# Altium schematic sheet MCU.SchDoc: Gimbal - Microcontroller
size Letter; DrawnBy: Aidan Gratton; Organization: UW Robotics; Address1: 200 University Avenue; Address2: Waterloo; Address3: Ontario; Address4: Canada N2L 3G6; SheetNumber: 4; SheetTotal: 7
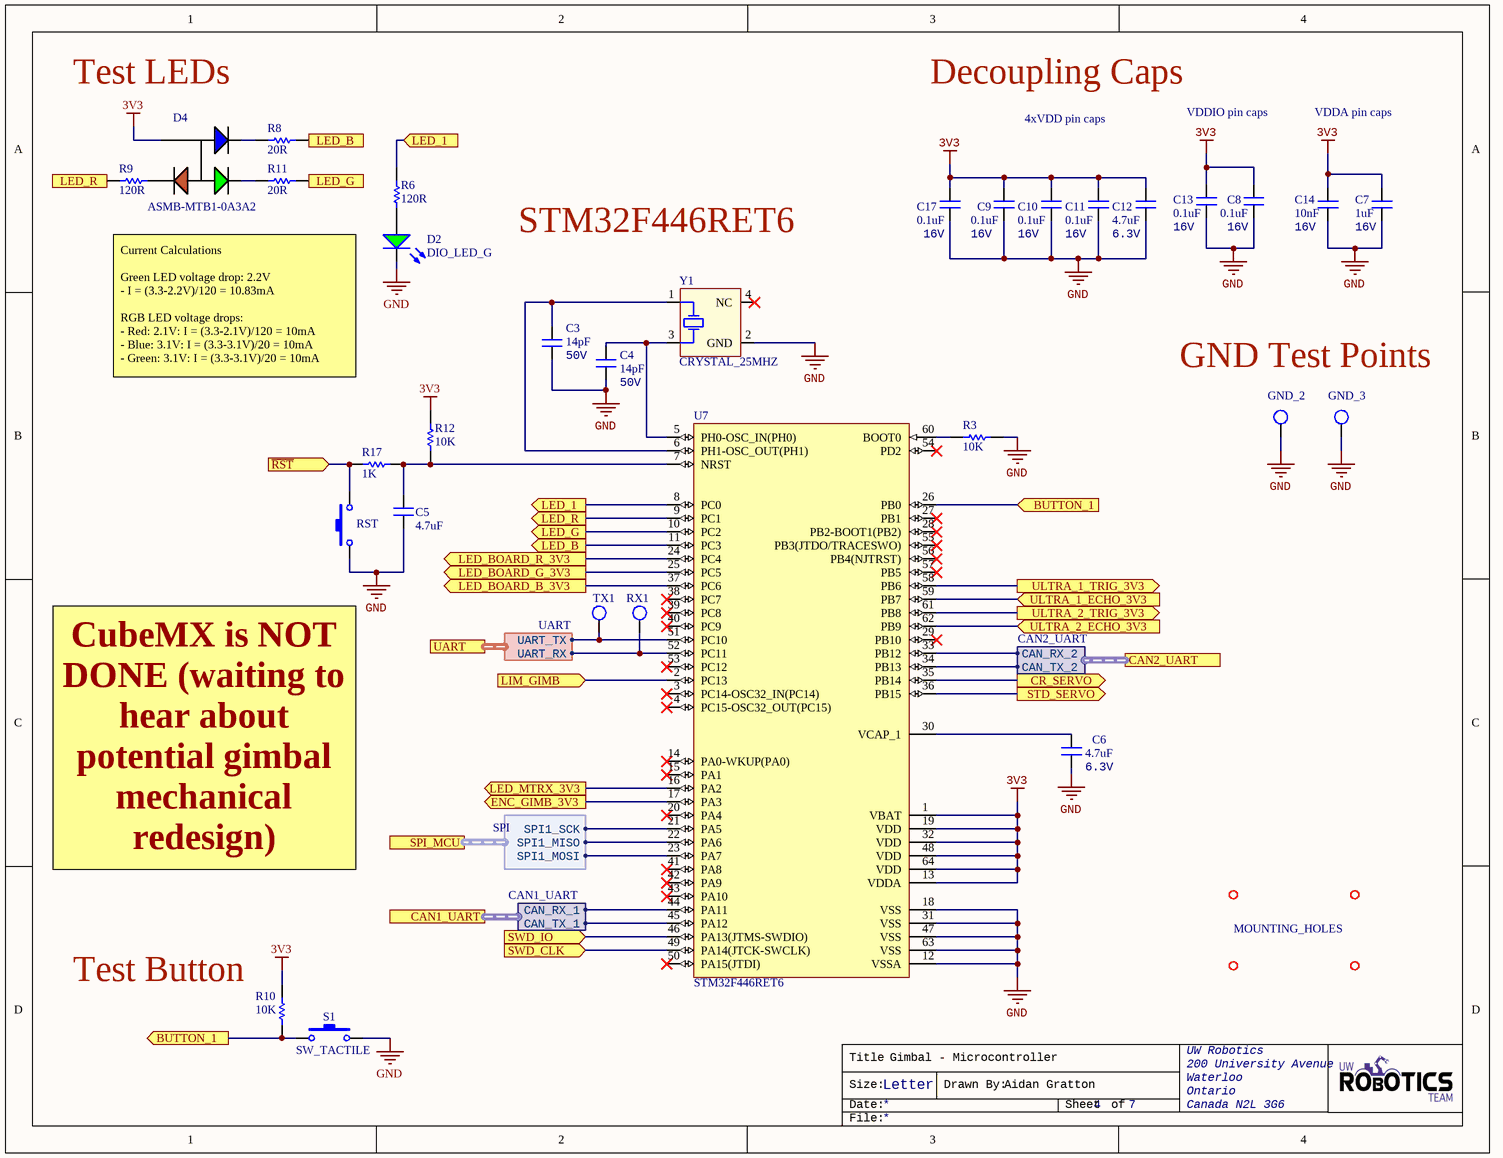
[diagram p0: MCU.SchDoc]

## Parts
C3  value 14pF  Voltage Rating (DC): 50V  [CAPC0603(1608)55_N]  (hidden comment: CL10C140JB8NNNC)
C4  value 14pF  Voltage Rating (DC): 50V  [CAPC0603(1608)55_N]  (hidden comment: CL10C140JB8NNNC)
C5  value 4.7uF  [CAPC0603(1608)55_N]  (hidden comment: CAP_4.7uF_0603)
C6  value 4.7uF  Voltage Rating: 6.3V  [CAPC0603(1608)55_N]  (hidden comment: CAP_4.7uF_0603)
C7  value 1uF  Voltage Rating: 16V  [CAPC0603(1608)55_N]  (hidden comment: CAP_1uF_16V_0603)
C8  value 0.1uF  Voltage Rating: 16V  [CAPC0603(1608)55_N]  (hidden comment: CAP_0.1uF_16V_0603)
C9  value 0.1uF  Voltage Rating: 16V  [CAPC0603(1608)55_N]  (hidden comment: CAP_0.1uF_16V_0603)
C10  value 0.1uF  Voltage Rating: 16V  [CAPC0603(1608)55_N]  (hidden comment: CAP_0.1uF_16V_0603)
C11  value 0.1uF  Voltage Rating: 16V  [CAPC0603(1608)55_N]  (hidden comment: CAP_0.1uF_16V_0603)
C12  value 4.7uF  Voltage Rating: 6.3V  [CAPC0603(1608)55_N]  (hidden comment: CAP_4.7uF_0603)
C13  value 0.1uF  Voltage Rating: 16V  [CAPC0603(1608)55_N]  (hidden comment: CAP_0.1uF_16V_0603)
C14  value 10nF  Voltage Rating: 16V  [CAPC0603(1608)55_N]  (hidden comment: CAP_10nF_0603)
C17  value 0.1uF  Voltage Rating: 16V  [CAPC0603(1608)55_N]  (hidden comment: CAP_0.1uF_16V_0603)
D2  DIO_LED_G  [LED_0805_LINE]
D4  Manufacturer Part Number 1: ASMB-MTB1-0A3A2  [LED_RGB]  (hidden comment: LED_RGB)
GND_2  TESTPOINT_LOOP  [TESTPOINT_LOOP]  (value not drawn)
GND_3  TESTPOINT_LOOP  [TESTPOINT_LOOP]  (value not drawn)
MH1  MOUNTING_HOLES  [MOUNTING_HOLE]
MH2  MOUNTING_HOLES  [MOUNTING_HOLE]  (value not drawn)
MH3  MOUNTING_HOLES  [MOUNTING_HOLE]  (value not drawn)
MH4  MOUNTING_HOLES  [MOUNTING_HOLE]  (value not drawn)
R3  value 10K  [RESC0603(1608)_N]  (hidden comment: RES_10K_0603)
R6  value 120R  [RESC0603(1608)_N]  (hidden comment: RES_120R_0603)
R8  value 20R  [RESC0603(1608)_N]  (hidden comment: RES_20R_0603)
R9  value 120R  [RESC0603(1608)_N]  (hidden comment: RES_120R_0603)
R10  value 10K  [RESC0603(1608)_N]  (hidden comment: RES_10K_0603)
R11  value 20R  [RESC0603(1608)_N]  (hidden comment: RES_20R_0603)
R12  value 10K  [RESC0603(1608)_N]  (hidden comment: RES_10K_0603)
R17  value 1K  [RESC0603(1608)_N]  (hidden comment: RES_1K_0603)
RST  SW_PWR  [PTS830GM140]  (value not drawn)
RX1  TESTPOINT_LOOP  [TESTPOINT_LOOP]  (value not drawn)
S1  SW_TACTILE  [B3U-1100P]
TX1  TESTPOINT_LOOP  [TESTPOINT_LOOP]  (value not drawn)
U7  STM32F446RET6  [STM-LQFP64_L]
Y1  CRYSTAL_25MHZ  [AVX-CX2520DB32000D0GEJZ1-4_V]

## Ports
BUTTON_1 (in), BUTTON_1 (out), CAN1_UART (harness CAN1_UART), CAN2_UART (harness CAN2_UART), CR_SERVO (out), ENC_GIMB_3V3 (out), LED_1 (in), LED_1 (out), LED_B (in), LED_B (out), LED_BOARD_B_3V3 (out), LED_BOARD_G_3V3 (out), LED_BOARD_R_3V3 (out), LED_G (in), LED_G (out), LED_MTRX_3V3 (out), LED_R (in), LED_R (out), LIM_GIMB (in), SPI_MCU (harness SPI), STD_SERVO (out), SWD_CLK (in), SWD_IO (in), UART (harness UART), ULTRA_1_ECHO_3V3 (in), ULTRA_1_TRIG_3V3 (out), ULTRA_2_ECHO_3V3 (in), ULTRA_2_TRIG_3V3 (out), ~{RST} (in)

## Harnesses
UART: UART_RX, UART_TX
CAN1_UART: CAN_RX_1, CAN_TX_1
CAN2_UART: CAN_RX_2, CAN_TX_2
SPI: SPI1_SCK, SPI1_MISO, SPI1_MOSI

## Nets
3V3: C7.2 C8.2 C9.2 C10.2 C11.2 C12.2 C13.2 C14.2 C17.2 D4.4 R10.1 R12.2 U7.1(VBAT) U7.13(VDDA) U7.19(VDD) U7.32(VDD) U7.48(VDD) U7.64(VDD)
GND: C3.1 C4.1 C5.1 C6.1 C7.1 C8.1 C9.1 C10.1 C11.1 C12.1 C13.1 C14.1 C17.1 D2.2(K) GND_2.1 GND_3.1 R3.2 RST.1 S1.2 U7.12(VSSA) U7.18(VSS) U7.31(VSS) U7.47(VSS) U7.63(VSS) Y1.2(GND)
~{RST}: R17.1 RST.2 ; port ~{RST}
BUTTON_1: R10.2 S1.1 U7.26(PB0) ; port BUTTON_1
CR_SERVO: U7.35(PB14) ; port CR_SERVO
ENC_GIMB_3V3: U7.17(PA3) ; port ENC_GIMB_3V3
LED_1: R6.1 U7.8(PC0) ; port LED_1
LED_B: R8.2 U7.11(PC3) ; port LED_B
LED_BOARD_B_3V3: U7.37(PC6) ; port LED_BOARD_B_3V3
LED_BOARD_G_3V3: U7.25(PC5) ; port LED_BOARD_G_3V3
LED_BOARD_R_3V3: U7.24(PC4) ; port LED_BOARD_R_3V3
LED_G: R11.2 U7.10(PC2) ; port LED_G
LED_MTRX_3V3: U7.16(PA2) ; port LED_MTRX_3V3
LED_R: R9.1 U7.9(PC1) ; port LED_R
LIM_GIMB: U7.2(PC13) ; port LIM_GIMB
STD_SERVO: U7.36(PB15) ; port STD_SERVO
SWD_CLK: U7.49(PA14(JTCK-SWCLK)) ; port SWD_CLK
SWD_IO: U7.46(PA13(JTMS-SWDIO)) ; port SWD_IO
ULTRA_1_ECHO_3V3: U7.59(PB7) ; port ULTRA_1_ECHO_3V3
ULTRA_1_TRIG_3V3: U7.58(PB6) ; port ULTRA_1_TRIG_3V3
ULTRA_2_ECHO_3V3: U7.62(PB9) ; port ULTRA_2_ECHO_3V3
ULTRA_2_TRIG_3V3: U7.61(PB8) ; port ULTRA_2_TRIG_3V3
NetC3_2: C3.2 U7.6(PH1-OSC_OUT(PH1)) Y1.1(HOT)
NetC4_2: C4.2 U7.5(PH0-OSC_IN(PH0)) Y1.3(HOT)
NetC5_2: C5.2 R12.1 R17.2 U7.7(NRST)
NetC6_2: C6.2 U7.30(VCAP_1)
NetD2_1: D2.1(A) R6.2
NetD4_1: D4.1 R9.2
NetD4_2: D4.2 R11.1
NetD4_3: D4.3 R8.1
NetR3_1: R3.1 U7.60(BOOT0)
NetRX1_1: RX1.1 U7.52(PC11) ; port UART.UART_RX
NetTX1_1: TX1.1 U7.51(PC10) ; port UART.UART_TX
NetU7_21: U7.21(PA5) ; port SPI_MCU.SPI1_SCK
NetU7_22: U7.22(PA6) ; port SPI_MCU.SPI1_MISO
NetU7_23: U7.23(PA7) ; port SPI_MCU.SPI1_MOSI
NetU7_33: U7.33(PB12) ; port CAN2_UART.CAN_RX_2
NetU7_34: U7.34(PB13) ; port CAN2_UART.CAN_TX_2
NetU7_44: U7.44(PA11) ; port CAN1_UART.CAN_RX_1
NetU7_45: U7.45(PA12) ; port CAN1_UART.CAN_TX_1

Not connected (* = marked no-connect by the designer): U7 3(PC14-OSC32_IN(PC14))* 4(PC15-OSC32_OUT(PC15))* 14(PA0-WKUP(PA0))* 15(PA1)* 20(PA4)* 27(PB1)* 28(PB2-BOOT1(PB2))* 29(PB10)* 38(PC7)* 39(PC8)* 40(PC9)* 41(PA8)* 42(PA9)* 43(PA10)* 50(PA15(JTDI))* 53(PC12)* 54(PD2)* 55(PB3(JTDO/TRACESWO))* 56(PB4(NJTRST))* 57(PB5)*; Y1 4(NC)*

## Notes on the sheet
- Test LEDs
- Decoupling Caps
- 4xVDD pin caps
- VDDIO pin caps
- VDDA pin caps
- STM32F446RET6
- Current Calculations
  Green LED voltage drop: 2.2V
  - I = (3.3-2.2V)/120 = 10.83mA
  RGB LED voltage drops:
  - Red: 2.1V: I = (3.3-2.1V)/120 = 10mA
  - Blue: 3.1V: I = (3.3-3.1V)/20 = 10mA
  - Green: 3.1V: I = (3.3-3.1V)/20 = 10mA
- GND Test Points
- CubeMX is NOT DONE (waiting to hear about potential gimbal mechanical redesign)
- (near R10) Test Button
- Title
- Size:
- Date:
- Letter
- Drawn By:
- Sheet
- of
- File:

## Library data of the parts
C3 C4 = CL10C140JB8NNNC: Cap Ceramic 14pF 50V C0G 5% SMD 0603 125C Cardboard T/R; Manufacturer 1: Samsung; Voltage Rating: 50V; Supplier Part Number 1: 1276-2187-1-ND; Supplier 1: Digi-Key; Manufacturer Part Number 1: CL10C140JB8NNNC; Stock 1: 187088; Pricing 1: 1=0.10000, 10=0.06700, 100=0.02980, 500=0.02130, 1000=0.01673 (USD); RoHS: Yes; Mount: Surface Mount; Case/Package: 0603; Case Code (Metric): 1608; Case Code (Imperial): 0603; Min Operating Temperature: -55°C; Max Operating Temperature: 125°C; Tolerance: 5%; Package Quantity: 1; Packaging: Tape and Reel; Dielectric: C0G; Length: 1.6mm; Height: 0.8mm; Width: 0.031inch; Depth: 0.8mm; Thickness: 0.035inch; Radiation Hardening: No; ComponentLink1URL: https://datasheet.ciiva.com/25782/cl10c140jb8nnnc-25782947.pdf?src-supplier=Digi-Key; ComponentLink1Description: https://datasheet.ciiva.com/25782/cl10c140jb8nnnc-25782947.pdf?src-supplier=Digi-Key; Capacitance: 14pF
C5 = CAP_4.7uF_0603: CAP CER 4.7UF 6.3V X5R 0603; Manufacturer Part Number 1: CC0603KRX5R5BB475; Manufacturer 1: Yageo; Dimensions: 0.063" L x 0.031" W (1.60mm x 0.80mm); Package: 0603 (1608 Metric); Temperature Coefficient: X5R; Voltage Rating: 6.3V; Supplier Part Number 1: 311-1521-1-ND; Supplier 1: Digi-Key; Mount: Surface Mount
C6 C12 = CAP_4.7uF_0603: CAP CER 4.7UF 6.3V X5R 0603; Manufacturer: Yageo; MPN: CC0603KRX5R5BB475; Dimensions: 0.063" L x 0.031" W (1.60mm x 0.80mm); Package: 0603 (1608 Metric); Temperature Coefficient: X5R; Supplier Part Number 1: 311-1521-1-ND; Supplier 1: Digi-Key
C7 = CAP_1uF_16V_0603: CAP CER 1UF 16V Y5V 0603; Manufacturer: Yageo; MPN: CC0603ZRY5V7BB105; Dimensions: 0.063" L x 0.031" W (1.60mm x 0.80mm); Package: 0603 (1608 Metric); Temperature Coefficient: Y5V; Supplier Part Number 1: 311-1372-1-ND; Supplier 1: Digi-Key
C8-C11 C13 C17 = CAP_0.1uF_16V_0603: CAP CER 0.1UF 16V X7R 0603; Manufacturer: Yageo; MPN: CC0603KRX7R7BB104; Dimensions: 0.063" L x 0.031" W (1.60mm x 0.80mm); Package: 0603 (1608 Metric); Temperature Coefficient: X7R; Supplier Part Number 1: 311-1088-1-ND; Supplier 1: Digi-Key
C14 = CAP_10nF_0603: CAP CER 10000PF 16V X7R 0603; Manufacturer: Yageo; MPN: CC0603KRX7R7BB103; Dimensions: 0.063" L x 0.031" W (1.60mm x 0.80mm); Package: 0603 (1608 Metric); Temperature Coefficient: X7R; Supplier Part Number 1: 311-3369-1-ND; Supplier 1: Digi-Key
D2 = DIO_LED_G: LED GREEN DIFFUSED 0805 SMD; Manufacturer: OSRAM; MPN: LG R971-KN-1; Forward Voltage Drop: 2.2V; Package: 0805 (2012 Metric); Supplier Part Number 1: 475-1410-1-ND; Supplier 1: Digi-Key
D4 = LED_RGB: LED RGB DIFFUSED 4PLCC SMD; Manufacturer 1: Broadcom; Color: Blue,Green,Red; Lens Color: White; Viewing Angle: 115°; Lens Style: Round; Luminous Intensity: 350mcd; Dominant Wavelength: 470nm; Forward Voltage: 3.1V; Test Current: 20mA; Supplier 1: Digi-Key; Stock 1: 142531; Pricing 1: 1=0.60000, 10=0.47100, 100=0.30210, 500=0.25980, 1000=0.20059 (USD); RoHS: Yes; Mount: Surface Mount; Case/Package: PLCC; Number of Pins: 4; Packaging: Cut Tape; Lens Transparency: Diffused; Length: 3.2mm; Height: 1.9mm; Width: 2.8mm; REACH SVHC: No SVHC; ComponentLink1URL: http://www.farnell.com/datasheets/2111106.pdf?src-supplier=Farnell; ComponentLink1Description: http://www.farnell.com/datasheets/2111106.pdf?src-supplier=Farnell; ComponentLink2URL: https://docs.broadcom.com/docs/AV02-4194EN?src-supplier=Digi-Key; ComponentLink2Description: https://docs.broadcom.com/docs/AV02-4194EN?src-supplier=Digi-Key; ComponentLink3URL: http://www.farnell.com/datasheets/1801564.pdf?src-supplier=Element14; ComponentLink3Description: http://www.farnell.com/datasheets/1801564.pdf?src-supplier=Element14; ComponentLink4URL: http://www.farnell.com/datasheets/2111106.pdf?src-supplier=Newark; ComponentLink4Description: http://www.farnell.com/datasheets/2111106.pdf?src-supplier=Newark; Supplier Part Number 1: 516-3280-1-ND
GND_2 GND_3 RX1 TX1 = TESTPOINT_LOOP: Loop testpoint through-hole pad; Manufacturer: Keystone Electronics; Manufacturer Part Number 1: 5002; Supplier Part Number 1: 36-5002-ND; Supplier 1: Digi-Key
MH1-MH4 = MOUNTING_HOLES: 6cm x 6cm
R3 R10 R12 = RES_10K_0603: RES SMD 10K OHM 5% 1/10W 0603; Manufacturer: Yageo; MPN: RC0603JR-0710KL; Package: 0603 (1608 Metric); Dimensions: 0.063" L x 0.031" W (1.60mm x 0.80mm); Tolerance: 5%; Supplier Part Number 1: 311-10KGRCT-ND; Supplier 1: Digi-Key
R6 R9 = RES_120R_0603: RES SMD 120 OHM 5% 1/10W 0603; Manufacturer: Yageo; MPN: RC0603JR-07120RL; Package: 0603 (1608 Metric); Dimensions: 0.063" L x 0.031" W (1.60mm x 0.80mm); Tolerance: 5%; Supplier Part Number 1: 311-120GRCT-ND; Supplier 1: Digi-Key
R8 R11 = RES_20R_0603: RES SMD 20 OHM 5% 1/10W 0603; Manufacturer: Yageo; MPN: RC0603JR-0720RL; Package: 0603 (1608 Metric); Dimensions: 0.063" L x 0.031" W (1.60mm x 0.80mm); Tolerance: 5%; Supplier Part Number 1: 311-20GRCT-ND; Supplier 1: Digi-Key
R17 = RES_1K_0603: RES SMD 1K OHM 5% 1/10W 0603; Manufacturer 1: Yageo; Manufacturer Part Number 1: RC0603JR-071KL; Dimensions: 0.063" L x 0.031" W (1.60mm x 0.80mm); Tolerance: 5%; Package: 0603 (1608 Metric); Supplier Part Number 1: 311-1.0KGRCT-ND; Supplier 1: Digi-Key; Mount: Surface Mount
RST = SW_PWR: Power Switch (Red); pin to pad: 2>4; MPN: PTS830GM140 SMTR LFS; Manufacturer: C&K; ComponentLink1Description: Datasheet; ComponentLink1URL: https://www.ckswitches.com/media/1478/pts830.pdf; Supplier Part Number 1: CKN10587CT-ND; Supplier 1: Digi-Key
S1 = SW_TACTILE: Tactile Switch (Grey); Manufacturer: Omron Electronics Inc-EMC Div; MPN: B3U-1100P; Supplier Part Number 1: SW1021CT-ND; Supplier 1: Digi-Key
U7 = MCU_STM32F446RET6: ARM Cortex-M4 32-bit MCU+FPU, 512 KB Flash, 128 KB Internal RAM, 50 I/Os, 64-Pin LQFP, -40 to 85 degC, Tray; I/Os (High Current): 50; Supply Voltage(Vcc) min (V): 1.7; Operating Frequency(F) (Processor speed) (MHz): 180; D/A Converter: 2; Internal RAM Size (kB): 128; FLASH Size (Prog) (kB): 512; Core: ARM Cortex-M4; ComponentLink1Description: Manufacturer URL; Package Reference: 64-Pin Low-profile Quad Flat Package, Body 10 x 10 mm, Pitch 0.5 mm; ComponentLink2URL: http://www.st.com/st-web-ui/static/active/en/resource/technical/document/datasheet/DM00141306.pdf; Packing: Tray; DatasheetVersion: Rev. 6; ComponentLink1URL: http://www.st.com/; ComponentLink2Description: Datasheet; Package Description: LQFP64; Mounting Technology: Surface Mount; Supplier Part Number 1: 497-15376-ND; Supplier 1: Digi-Key
Y1 = CRYSTAL_25MHZ: CRYSTAL 25.0000MHZ 12PF SMD; Manufacturer 1: Kyocera AVX; Manufacturer Part Number 1: CX2520DB25000H0FLJC1; Frequency: 25MHz; ESR (Equivalent Series Resistance): 80R; Frequency Stability: 15ppm; Frequency Tolerance: 10ppm; ComponentLink1Description: https://media.digikey.com/pdf/Data%20Sheets/AVX%20PDFs/CX2520DB_USY1M-H1-16429-00_Spec.pdf?src-supplier=Digi-Key; ComponentLink1URL: https://media.digikey.com/pdf/Data%20Sheets/AVX%20PDFs/CX2520DB_USY1M-H1-16429-00_Spec.pdf?src-supplier=Digi-Key; Supplier 1: Digi-Key; Supplier Part Number 1: 1253-1724-1-ND; Stock 1: 11741; Pricing 1: 1=0.72000, 10=0.63300, 50=0.59120, 100=0.52250, 500=0.49500, 1000=0.41250 (USD); RoHS: Yes; Mount: Surface Mount; Case/Package: SMD/SMT; Min Operating Temperature: -30°C; Max Operating Temperature: 85°C; Packaging: Tape and Reel; Load Capacitance: 12pF; Length: 0.098inch; Height: 0.022inch; Width: 0.079inch; Ratings: AEC-Q200